# Altium schematic sheet Vref.SchDoc
size A4; SheetNumber: 2; SheetTotal: 6
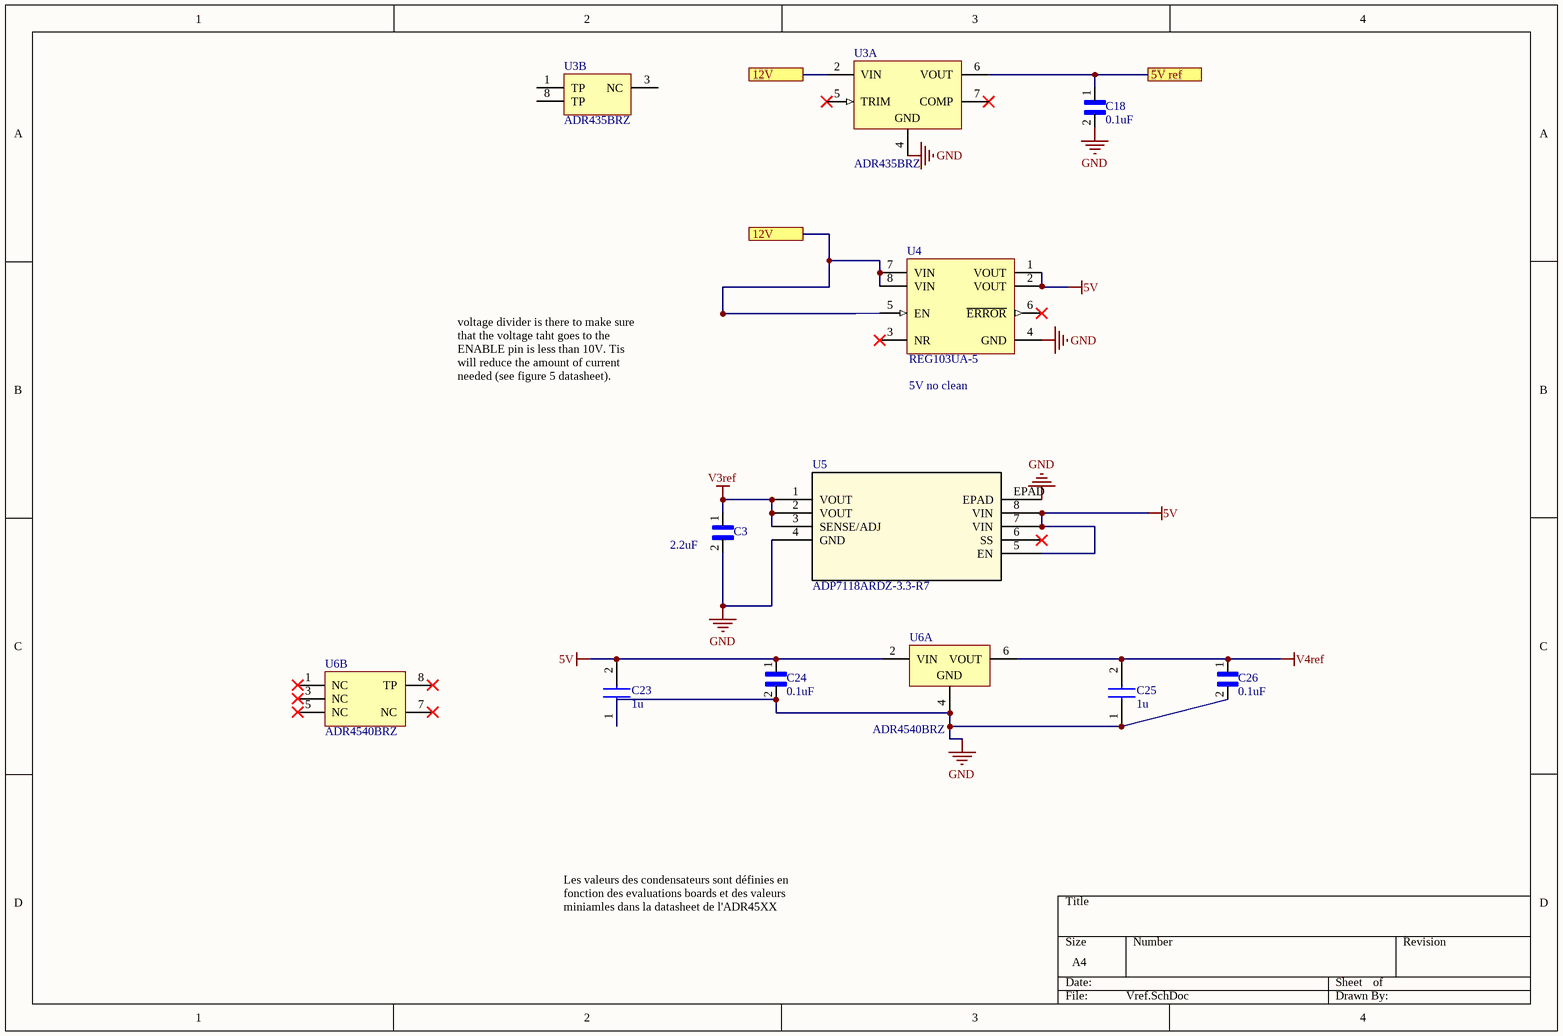
[diagram p0: Vref.SchDoc]

## Parts
C3  2.2uF  [CAPC1608X90]
C18  0.1uF  [CAPC1608X90N]
C23  1u  [CAPC1608X90N]
C24  0.1uF  [CAPC1608X90N]
C25  1u  [CAPC1608X90N]
C26  0.1uF  [CAPC1608X90N]
U3  ADR435BRZ  [ADI-R-8_M]  (parts A,B of 2)
U4  REG103UA-5  [D0008A_M]
U5  ADP7118ARDZ-3.3-R7  [SOIC_08_EP_3P9X4P9_ADI]
U6  ADR4540BRZ  [ADI-R-8_M]  (parts A,B of 2)

## Ports
5V ref, 12V

## Nets
5V: C23.2 C24.1 U4.1(VOUT) U4.2(VOUT) U5.5(EN) U5.7(VIN) U5.8(VIN) U6.2(VIN)
GND: C3.2 C18.2 C23.1 C24.2 C25.1 C26.2 U3.4(GND) U4.4(GND) U5.4(GND) U5.EPAD U6.4(GND)
V3ref: C3.1 U5.1(VOUT) U5.2(VOUT) U5.3(SENSE/ADJ)
V4ref: C25.2 C26.1 U6.6(VOUT)
5V ref: C18.1 U3.6(VOUT) ; port 5V ref
12V: U3.2(VIN) U4.5(EN) U4.7(VIN) U4.8(VIN) ; port 12V

Not connected (* = marked no-connect by the designer): U3 1(TP) 3(NC) 5(TRIM)* 7(COMP)* 8(TP); U4 3(NR)* 6(~{ERROR})*; U5 6(SS)*; U6 1(NC)* 3(NC)* 5(NC)* 7(NC)* 8(TP)*

## Notes on the sheet
- voltage divider is there to make sure that the voltage taht goes to the ENABLE pin is less than 10V. Tis will reduce the amount of current needed (see figure 5 datasheet).
- (near U4) 5V no clean
- Les valeurs des condensateurs sont définies en fonction des evaluations boards et des valeurs miniamles dans la datasheet de l'ADR45XX

## Library data of the parts
C3 = CMP-003-000006-1: 2.2UF 16V 20%; MP: F981C225MMA; MF: {'manufacturer': u'AVX'}; Package: None; Availability: Unavailable; Value: *; Price: None; Component Type: Standard; Design Item ID: F981C225MMA; Pin Count: 2; Source: workerBoard.SCHLIB
C18 C24 C26 = CMP-003-000001-1: Cap Ceramic 0.1uF 25V X5R 10% SMD 0603 85ÂÂŽ T/R; MF: {'manufacturer': u'AVX'}; Price: None; Availability: Unavailable; Value: *; MP: 06033D104KAT2A; Package: None; Component Type: Standard; Design Item ID: 06033D104KAT2A; Pin Count: 2; Source: workerBoard.SCHLIB
C23 C25 = CMP-003-000003-1: Capacitor; Manufacturer_Name: AVX; Datasheet Link: https://componentsearchengine.com/Datasheets/1/06031A100FAT2A.pdf; Height: 0.9mm; Manufacturer_Part_Number: 0603YC105MAT4A; Component Type: Standard; Design Item ID: 0603YC105MAT4A; Pin Count: 2; Source: workerBoard.SCHLIB
U3 = CMP-006-000001-1: Ultralow Noise XFET Voltage Reference with Current Sink and Source Capability, 5 V Output, 7 to 18 V Supply, Industrial, 8-pin SOIC (R-8), Tube; Manufacturer: Analog Devices; Max V Supply (V): 18; Vout: 5V; Ref Out TC (ppm/C): 1; Min V Supply (V): 7; ComponentLink4Description: URL Link1; ComponentLink3Description: Package Specification; Mounting Technology: Surface Mount; DatasheetVersion: Rev. J; PackageDescription: 8-Pin Standard Small Outline Package, Body 4.9 x 3.9 mm, Pitch 1.27 mm; Packing: Tube; PackageVersion: 060506-A, 06/2006; PackageReference: R-8; ComponentLink2Description: Datasheet; PartNumber: ADR435BRZ; ComponentLink3URL: http://www.analog.com/static/imported-files/packages/PKG_PDF/SOIC_Narrow%20(R)/R_8.pdf; ComponentLink1Description: Manufacturer URL; ComponentLink2URL: http://www.analog.com/static/imported-files/data_sheets/ADR430_431_433_434_435_439.pdf; Operating Temp Range: -40 to 125 degC; Code_JEDEC: MS-012-AA; ComponentLink4URL: Product URL:http://www.analog.com/en/special-linear-functions/voltage-references/adr435/products/product.html; ComponentLink1URL: http://www.analog.com/en/index.html; Component Type: Standard; Design Item ID: CMP-0784-00226-1; Manufacturer Part Number: ADR435BRZ; Pin Count: 8; Source: workerBoard.SCHLIB
U4 = CMP-010-000004-1: Single Output Fast Transient Response LDO, 500 mA, Fixed 5 V Output, 2.1 to 15 V Input, 8-pin SOIC (D), -55 to 125 degC, Green (RoHS & no Sb/Br); Manufacturer: Texas Instruments; Vdo(Typ)(mV): 160; Accuracy(%): 2; Iq(Typ)(mA): 0.5; Vin(Max)(V): 15; Power Good: TRUE; SubFamily: Single Channel LDO; Vout Adj(Max)(V): 5; Vin(Min)(V): 2.1; Mounting Technology: Surface Mount; ComponentLink1URL: http://www.ti.com/; PackageReference: D0008A; ComponentLink1Description: Manufacturer URL; Eco-Plan: Green (RoHS & no Sb/Br); PackageVersion: 4040047-3/M; PartNumber: REG103UA-5; Code_JEDEC: MS-012; DatasheetVersion: SBVS010D; ComponentLink2Description: Datasheet; PackageDescription: 8-Pin Plastic Small Outline, Body 4.9 x 3.9 mm, Pitch 1.27 mm; ComponentLink2URL: http://www.ti.com/general/docs/lit/getliterature.tsp?genericPartNumber=REG103-5&fileType=pdf; ComponentLink3URL: http://www.ti.com/litv/pdf/msoi002j; Fixed Output Options(V): 5; Iout(Max)(A): 0.5; Vout Adj(Min)(V): 5; ComponentLink3Description: Package Specification; Component Type: Standard; Design Item ID: CMP-0395-00135-2; Manufacturer Part Number: REG103UA-5; Pin Count: 8; Source: workerBoard.SCHLIB
U5 = CMP-010-000001-1: No Description Available; Mfr_Name: Analog Devices Inc; Copyright: Copyright (C) 2021 Ultra Librarian. All rights reserved.; Manufacturer_Part_Number: ADP7118ARDZ-3.3-R7; RefDes: RefDes; Type: DEV; Component Type: Standard; Design Item ID: ADP7118ARDZ-3.3-R7; Pin Count: 9; Source: workerBoard.SCHLIB
U6 = CMP-006-000000-1: Ultralow Noise, High Accuracy Voltage Reference, 4.096 V Output, 3 to 15 V Supply, Industrial, 8-pin SOIC (R-8), Tube; Manufacturer: Analog Devices; Max V Supply (V): 15; Min V Supply (V): 3; Vout: 4.096V; Ref Out TC (ppm/C): 2; ComponentLink4URL: Product URL:http://www.analog.com/en/special-linear-functions/voltage-references/adr4540/products/product.html; Mounting Technology: Surface Mount; ComponentLink1Description: Manufacturer URL; PackageDescription: 8-Pin Standard Small Outline Package, Body 4.9 x 3.9 mm, Pitch 1.27 mm; ComponentLink2URL: http://www.analog.com/static/imported-files/data_sheets/ADR4520_4525_4530_4533_4540_4550.pdf; ComponentLink1URL: http://www.analog.com/en/index.html; DatasheetVersion: Rev. 0; ComponentLink4Description: URL Link1; Operating Temp Range: -40 to 125 degC; PartNumber: ADR4540BRZ; ComponentLink2Description: Datasheet; ComponentLink3URL: http://www.analog.com/static/imported-files/packages/PKG_PDF/SOIC_Narrow%20(R)/R_8.pdf; ComponentLink3Description: Package Specification; PackageVersion: 060506-A, 06/2006; Packing: Tube; PackageReference: R-8; Code_JEDEC: MS-012-AA; Component Type: Standard; Design Item ID: CMP-0784-00192-1; Manufacturer Part Number: ADR4540BRZ; Pin Count: 8; Source: workerBoard.SCHLIB